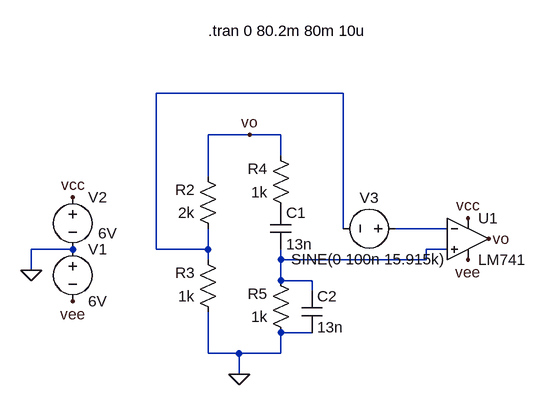
[diagram p0: schematic wien_bridge_osc_using_opamp.asc]
wien_bridge_osc_using_opamp.asc, the LTspice schematic file:
Version 4.1
SHEET 1 880 680
WIRE 400 -80 112 -80
WIRE 256 -16 192 -16
WIRE 304 -16 256 -16
WIRE 304 16 304 -16
WIRE 192 48 192 -16
WIRE 400 128 400 -80
WIRE 560 128 480 128
WIRE -16 160 -80 160
WIRE 112 160 112 -80
WIRE 192 160 192 128
WIRE 192 160 112 160
WIRE 560 160 528 160
WIRE 192 176 192 160
WIRE 304 176 304 160
WIRE 528 176 528 160
WIRE 528 176 304 176
WIRE -80 192 -80 160
WIRE 304 208 304 176
WIRE 352 208 304 208
WIRE 352 224 352 208
WIRE 352 288 304 288
WIRE 192 320 192 256
WIRE 240 320 192 320
WIRE 304 320 304 288
WIRE 304 320 240 320
WIRE 240 352 240 320
FLAG -80 192 0
FLAG 592 112 vcc
FLAG -16 80 vcc
FLAG 592 176 vee
FLAG -16 240 vee
FLAG 256 -16 vo
FLAG 624 144 vo
FLAG 240 352 0
SYMBOL voltage -16 144 R0
WINDOW 123 0 0 Left 0
WINDOW 39 0 0 Left 0
SYMATTR InstName V1
SYMATTR Value 6V
SYMBOL voltage -16 64 R0
WINDOW 3 39 71 Left 2
WINDOW 123 0 0 Left 0
WINDOW 39 0 0 Left 0
SYMATTR InstName V2
SYMATTR Value 6V
SYMBOL LM741 592 80 R0
SYMATTR InstName U1
SYMBOL res 208 144 R180
WINDOW 0 36 76 Left 2
WINDOW 3 36 40 Left 2
SYMATTR InstName R2
SYMATTR Value 2k
SYMBOL res 208 272 R180
WINDOW 0 36 76 Left 2
WINDOW 3 36 40 Left 2
SYMATTR InstName R3
SYMATTR Value 1k
SYMBOL res 320 112 R180
WINDOW 0 36 76 Left 2
WINDOW 3 36 40 Left 2
SYMATTR InstName R4
SYMATTR Value 1k
SYMBOL res 320 304 R180
WINDOW 0 36 76 Left 2
WINDOW 3 36 40 Left 2
SYMATTR InstName R5
SYMATTR Value 1k
SYMBOL cap 288 96 R0
SYMATTR InstName C1
SYMATTR Value 13n
SYMBOL cap 336 224 R0
SYMATTR InstName C2
SYMATTR Value 13n
SYMBOL voltage 496 128 R90
WINDOW 0 -32 56 VBottom 2
WINDOW 3 32 56 VTop 2
WINDOW 123 0 0 Left 0
WINDOW 39 0 0 Left 0
SYMATTR InstName V3
SYMATTR Value SINE(0 100n 15.915k)
TEXT 192 -176 Left 2 !.tran 0 80.2m 80m 10u

The netlist it stands for:
* wien_bridge_osc_using_opamp.asc
V1 0 vee 6V
V2 vcc 0 6V
X§U1 N003 N002 vcc vee vo LM741  ; pins In+ In- V+ V- OUT
R2 N001 vo 2k
R3 0 N001 1k
R4 P001 vo 1k
R5 0 N003 1k
C1 P001 N003 13n
C2 N003 0 13n
V3 N002 N001 SINE(0 100n 15.915k)
.tran 0 80.2m 80m 10u
.lib LM741.lib
.backanno
.end